# Altium schematic sheet STC最小系统板.SCHDOC
size A4
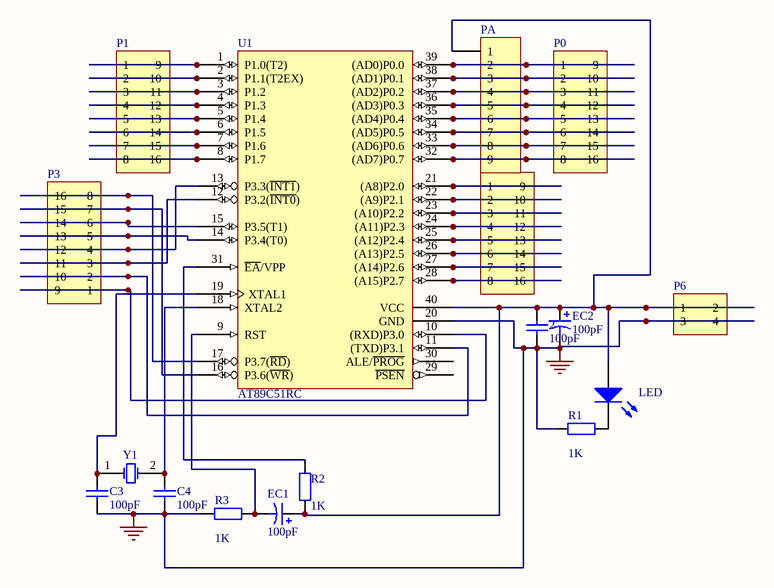
[diagram p0: STC最小系统板.SCHDOC]

## Parts
2  value 100pF  [CAPR5-4X5]  (hidden comment: Cap Semi)
C3  value 100pF  [CAPR5-4X5]  (hidden comment: Cap Semi)
C4  value 100pF  [CAPR5-4X5]  (hidden comment: Cap Semi)
EC1  value 100pF  [CAPPR1.5-4x5]  (hidden comment: Cap Pol1)
EC2  value 100pF  [CAPPR1.5-4x5]  (hidden comment: Cap Pol1)
LED  LED0  [CAPPR1.27-1.7x2.8]  (value not drawn)
P0  Header 8X2A  [HDR2X8_CEN]  (value not drawn)
P1  Header 8X2A  [HDR2X8_CEN]  (value not drawn)
P2  Header 8X2A  [HDR2X8_CEN]  (value not drawn)
P3  Header 8X2A  [HDR2X8_CEN]  (value not drawn)
P6  MHDR2X2  [MHDR2X2]  (value not drawn)
PA  Header 9  [HDR1X9]  (value not drawn)
R1  value 1K  [AXIAL-0.4]  (hidden comment: Res2)
R2  value 1K  [AXIAL-0.4]  (hidden comment: Res2)
R3  value 1K  [AXIAL-0.4]  (hidden comment: Res2)
U1  AT89C51RC  [DIP-40]
Y1  XTAL  [RAD-0.2]  (value not drawn)

## Nets
GND: 2.1 C3.2 C4.2 EC2.2 P6.3 P6.4 R1.2 R3.2 U1.20(GND)
Net2_2: 2.2 EC1.1 EC2.1 LED.1(A) P6.1 P6.2 PA.1 R2.2 U1.40(VCC)
NetC3_1: C3.1 U1.19(XTAL1) Y1.1(OSC1)
NetC4_1: C4.1 U1.18(XTAL2) Y1.2(OSC2)
NetEC1_2: EC1.2 R3.1 U1.9(RST)
NetLED_2: LED.2(K) R1.1
NetP0_1: P0.1 P0.9 PA.2 U1.39((AD0)P0.0)
NetP0_2: P0.2 P0.10 PA.3 U1.38((AD1)P0.1)
NetP0_3: P0.3 P0.11 PA.4 U1.37((AD2)P0.2)
NetP0_4: P0.4 P0.12 PA.5 U1.36((AD3)P0.3)
NetP0_5: P0.5 P0.13 PA.6 U1.35((AD4)P0.4)
NetP0_6: P0.6 P0.14 PA.7 U1.34((AD5)P0.5)
NetP0_7: P0.7 P0.15 PA.8 U1.33((AD6)P0.6)
NetP0_8: P0.8 P0.16 PA.9 U1.32((AD7)P0.7)
NetP1_1: P1.1 P1.9 U1.1(P1.0(T2))
NetP1_2: P1.2 P1.10 U1.2(P1.1(T2EX))
NetP1_3: P1.3 P1.11 U1.3(P1.2)
NetP1_4: P1.4 P1.12 U1.4(P1.3)
NetP1_5: P1.5 P1.13 U1.5(P1.4)
NetP1_6: P1.6 P1.14 U1.6(P1.5)
NetP1_7: P1.7 P1.15 U1.7(P1.6)
NetP1_8: P1.8 P1.16 U1.8(P1.7)
NetP2_1: P2.1 P2.9 U1.21((A8)P2.0)
NetP2_2: P2.2 P2.10 U1.22((A9)P2.1)
NetP2_3: P2.3 P2.11 U1.23((A10)P2.2)
NetP2_4: P2.4 P2.12 U1.24((A11)P2.3)
NetP2_5: P2.5 P2.13 U1.25((A12)P2.4)
NetP2_6: P2.6 P2.14 U1.26((A13)P2.5)
NetP2_7: P2.7 P2.15 U1.27((A14)P2.6)
NetP2_8: P2.8 P2.16 U1.28((A15)P2.7)
NetP3_1: P3.1 P3.9 U1.10((RXD)P3.0)
NetP3_2: P3.2 P3.10 U1.11((TXD)P3.1)
NetP3_3: P3.3 P3.11 U1.12(P3.2(~{INT0}))
NetP3_4: P3.4 P3.12 U1.13(P3.3(~{INT1}))
NetP3_5: P3.5 P3.13 U1.14(P3.4(T0))
NetP3_6: P3.6 P3.14 U1.15(P3.5(T1))
NetP3_7: P3.7 P3.15 U1.16(P3.6(~{WR}))
NetP3_8: P3.8 P3.16 U1.17(P3.7(~{RD}))
NetR2_1: R2.1 U1.31(~{EA}/VPP)

Not connected (* = marked no-connect by the designer): U1 29(~{PSEN}) 30(ALE/~{PROG})

## Library data of the parts
2 C3 C4 = Cap Semi: Capacitor (Semiconductor SIM Model); Published: 8-Jun-2000; LatestRevisionDate: 17-Jul-2002; LatestRevisionNote: Re-released for DXP Platform.; PackageReference: C1206; Publisher: Altium Limited
EC1 EC2 = Cap Pol1: Polarized Capacitor (Radial); Published: 8-Jun-2000; LatestRevisionDate: 17-Jul-2002; LatestRevisionNote: Re-released for DXP Platform.; Publisher: Altium Limited
LED = LED0: Typical INFRARED GaAs LED; Published: 8-Jun-2000; LatestRevisionDate: 17-Jul-2002; LatestRevisionNote: Re-released for DXP Platform.; Publisher: Altium Limited
P0-P3 = Header 8X2A: Header, 8-Pin, Dual row; LatestRevisionDate: 17-Jul-2002; LatestRevisionNote: Re-released for DXP Platform.; Publisher: Altium Limited
P6 = MHDR2X2: Header, 2-Pin, Dual row; LatestRevisionDate: 17-Jul-2002; LatestRevisionNote: Re-released for DXP Platform.; Publisher: Altium Limited
PA = Header 9: Header, 9-Pin; LatestRevisionDate: 17-Jul-2002; LatestRevisionNote: Re-released for DXP Platform.; Publisher: Altium Limited
R1-R3 = Res2: Resistor; Published: 8-Jun-2000; LatestRevisionDate: 17-Jul-2002; LatestRevisionNote: Re-released for DXP Platform.; Publisher: Altium Limited
U1 = AT89C51RC: 8-Bit Microcontroller with 32K Flash ROM
Y1 = XTAL: Crystal Oscillator; Published: 8-Jun-2000; LatestRevisionDate: 17-Jul-2002; LatestRevisionNote: Re-released for DXP Platform.; Publisher: Altium Limited